# EasyEDA schematic SCH_solarWay_2025-11-07.json
TITLE: Sheet_1; REV: 1.0; Date: 2025-06-18; Sheet: 1/1; Drawn By: sahoneromassimo; Company: Your Company
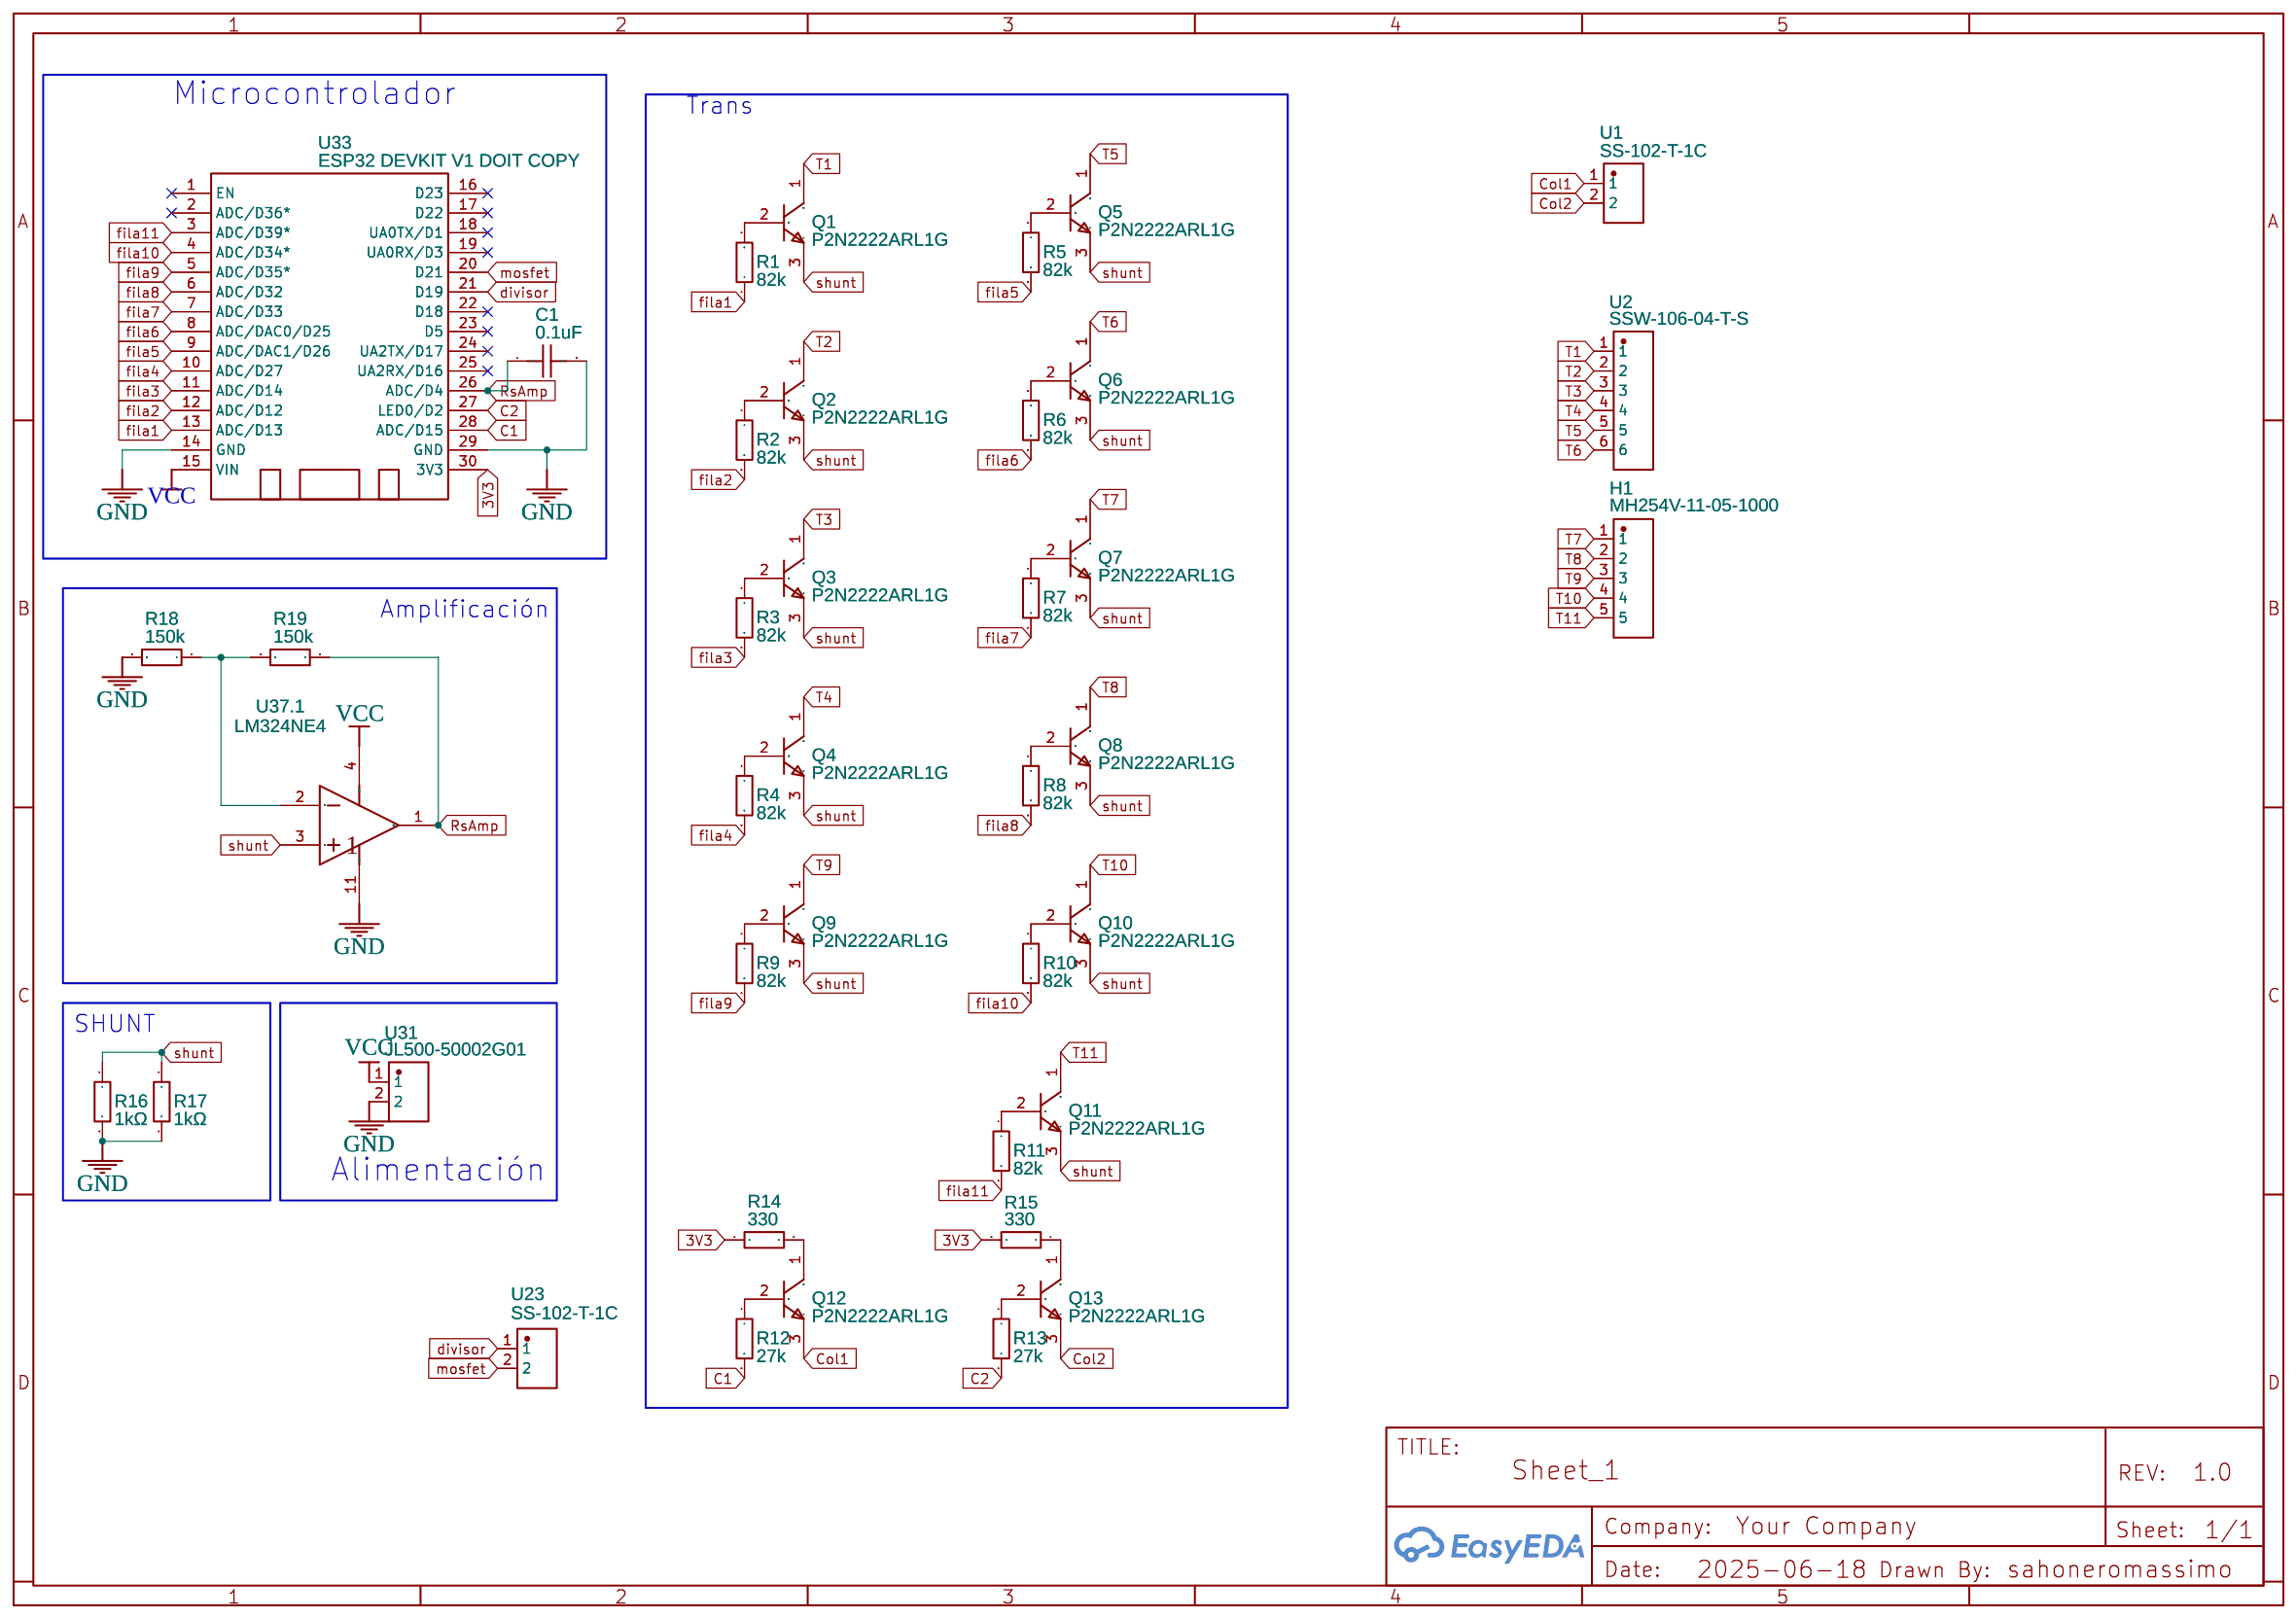
[diagram p0: schematic sheet]

## Parts
C1  0.1uF  [CAP-TH_L4.9-W3.7-P5.08-D0.5]
H1  MH254V-11-05-1000  [HDR-TH_5P-P2.54-V-M-1]
Q1  P2N2222ARL1G  [ONSC-TO-92-3-29-11_AM_BL]
Q2  P2N2222ARL1G  [ONSC-TO-92-3-29-11_AM_BL]
Q3  P2N2222ARL1G  [ONSC-TO-92-3-29-11_AM_BL]
Q4  P2N2222ARL1G  [ONSC-TO-92-3-29-11_AM_BL]
Q5  P2N2222ARL1G  [ONSC-TO-92-3-29-11_AM_BL]
Q6  P2N2222ARL1G  [ONSC-TO-92-3-29-11_AM_BL]
Q7  P2N2222ARL1G  [ONSC-TO-92-3-29-11_AM_BL]
Q8  P2N2222ARL1G  [ONSC-TO-92-3-29-11_AM_BL]
Q9  P2N2222ARL1G  [ONSC-TO-92-3-29-11_AM_BL]
Q10  P2N2222ARL1G  [ONSC-TO-92-3-29-11_AM_BL]
Q11  P2N2222ARL1G  [ONSC-TO-92-3-29-11_AM_BL]
Q12  P2N2222ARL1G  [ONSC-TO-92-3-29-11_AM_BL]
Q13  P2N2222ARL1G  [ONSC-TO-92-3-29-11_AM_BL]
R1  82k  [RES-TH_BD2.2-L6.5-P10.50-D0.6]
R2  82k  [RES-TH_BD2.2-L6.5-P10.50-D0.6]
R3  82k  [RES-TH_BD2.2-L6.5-P10.50-D0.6]
R4  82k  [RES-TH_BD2.2-L6.5-P10.50-D0.6]
R5  82k  [RES-TH_BD2.2-L6.5-P10.50-D0.6]
R6  82k  [RES-TH_BD2.2-L6.5-P10.50-D0.6]
R7  82k  [RES-TH_BD2.2-L6.5-P10.50-D0.6]
R8  82k  [RES-TH_BD2.2-L6.5-P10.50-D0.6]
R9  82k  [RES-TH_BD2.2-L6.5-P10.50-D0.6]
R10  82k  [RES-TH_BD2.2-L6.5-P10.50-D0.6]
R11  82k  [RES-TH_BD2.2-L6.5-P10.50-D0.6]
R12  27k  [RES-TH_BD2.2-L6.5-P10.50-D0.6]
R13  27k  [RES-TH_BD2.2-L6.5-P10.50-D0.6]
R14  330  [RES-TH_BD2.2-L6.5-P10.50-D0.6]
R15  330  [RES-TH_BD2.2-L6.5-P10.50-D0.6]
R16  1kΩ  [RES-TH_BD2.2-L6.5-P10.50-D0.6]
R17  1kΩ  [RES-TH_BD2.2-L6.5-P10.50-D0.6]
R18  150k  [RES-TH_BD2.2-L6.5-P10.50-D0.6]
R19  150k  [RES-TH_BD2.2-L6.5-P10.50-D0.6]
U1  SS-102-T-1C  [HDR-TH_2P-P2.54-V-M-1]
U2  SSW-106-04-T-S  [HDR-TH_6P-P2.54-V-M-1]
U23  SS-102-T-1C  [HDR-TH_2P-P2.54-V-M-1]
U31  JL500-50002G01  [CONN-TH_2P-P5.08_JL500-50002G01]
U33  ESP32 DEVKIT V1 DOIT COPY  [DOIT-ESP32-DEVKIT-V1]
U37  LM324NE4  [PDIP-14_L19.3-W6.4-P2.54-LS7.9-BL-1]  (section 1)

## Library data of the parts
C1 = CC4-0805-CG-100V-330PF-J: Contributor: LCSC; Supplier: LCSC; Supplier Part: C454432; Manufacturer: TORCH(火炬); Manufacturer Part: CC4-0805-CG-100V-330pF-J; JLCPCB Part Class: Extended Part
H1 = MH254V-11-05-1000: Contributor: LCSC; Supplier: LCSC; Supplier Part: C2889981; Manufacturer: XFCN(兴飞); JLCPCB Part Class: Extended Part
Q1-Q13 = P2N2222ARL1G: Amplifier Transistor, NPN Silicon, 3-Pin TO-92, Pb-Free, Tape and Reel
R1-R19 = CFR0W4J0242A50: Contributor: lcsc; Supplier: LCSC; Supplier Part: C2905203; Manufacturer: UNI-ROYAL(厚声); JLCPCB Part Class: Extended Part
U1 U23 = SS-102-T-1C: Supplier: LCSC; Supplier Part: C7369778; Manufacturer: SAMTEC; JLCPCB Part Class: Extended Part; Contributor: lcsc
U2 = SSW-106-04-T-S: Supplier: LCSC; Supplier Part: C7322394; Manufacturer: SAMTEC; JLCPCB Part Class: Extended Part; Contributor: lcsc
U31 = JL500-50002G01: Contributor: LCSC; Supplier: LCSC; Supplier Part: C394555; Manufacturer: JILN(锦凌); JLCPCB Part Class: Extended Part
U33 = ESP32 DEVKIT V1 DOIT COPY: Contributor: ConceitoTeam
U37 = LM324NE4: subpart_no: 1; Supplier: LCSC; Supplier Part: C1348021; Manufacturer: TI(德州仪器); JLCPCB Part Class: Extended Part

## Nets
3V3: R14.2 R15.2 U33.30(3V3)
GND: C1.2 R16.2 R17.2 R18.2 U31.2 U33.14(GND) U33.29(GND) U37.11(GND)
VCC: U31.1 U33.15(VIN) U37.4(VCC)
C1: R12.2 U33.28(ADC/D15)
C2: R13.2 U33.27(LED0/D2)
Col1: Q12.3(E) U1.1
Col2: Q13.3(E) U1.2
divisor: U23.1 U33.21(D19)
fila1: R1.1 U33.13(ADC/D13)
fila2: R2.2 U33.12(ADC/D12)
fila3: R3.2 U33.11(ADC/D14)
fila4: R4.2 U33.10(ADC/D27)
fila5: R5.2 U33.9(ADC/DAC1/D26)
fila6: R6.2 U33.8(ADC/DAC0/D25)
fila7: R7.2 U33.7(ADC/D33)
fila8: R8.2 U33.6(ADC/D32)
fila9: R9.2 U33.5(ADC/D35*)
fila10: R10.2 U33.4(ADC/D34*)
fila11: R11.2 U33.3(ADC/D39*)
mosfet: U23.2 U33.20(D21)
RsAmp: C1.1 R19.1 U33.26(ADC/D4) U37.1(OUT1)
shunt: Q1.3(E) Q2.3(E) Q3.3(E) Q4.3(E) Q5.3(E) Q6.3(E) Q7.3(E) Q8.3(E) Q9.3(E) Q10.3(E) Q11.3(E) R16.1 R17.1 U37.3(IN1+)
T1: Q1.1(C) U2.1
T2: Q2.1(C) U2.2
T3: Q3.1(C) U2.3
T4: Q4.1(C) U2.4
T5: Q5.1(C) U2.5
T6: Q6.1(C) U2.6
T7: H1.1 Q7.1(C)
T8: H1.2 Q8.1(C)
T9: H1.3 Q9.1(C)
T10: H1.4 Q10.1(C)
T11: H1.5 Q11.1(C)
Net-(Q1-2): Q1.2(B) R1.2
Net-(Q2-2): Q2.2(B) R2.1
Net-(Q3-2): Q3.2(B) R3.1
Net-(Q4-2): Q4.2(B) R4.1
Net-(Q5-2): Q5.2(B) R5.1
Net-(Q6-2): Q6.2(B) R6.1
Net-(Q7-2): Q7.2(B) R7.1
Net-(Q8-2): Q8.2(B) R8.1
Net-(Q9-2): Q9.2(B) R9.1
Net-(Q10-2): Q10.2(B) R10.1
Net-(Q11-2): Q11.2(B) R11.1
Net-(Q12-1): Q12.1(C) R14.1
Net-(Q12-2): Q12.2(B) R12.1
Net-(Q13-1): Q13.1(C) R15.1
Net-(Q13-2): Q13.2(B) R13.1
Net-(R18-1): R18.1 R19.2 U37.2(IN1-)

Not connected (* = marked no-connect by the designer): U33 1(EN)* 2(ADC/D36*)* 16(D23)* 17(D22)* 18(UA0TX/D1)* 19(UA0RX/D3)* 22(D18)* 23(D5)* 24(UA2TX/D17)* 25(UA2RX/D16)*

## Notes on the sheet
- Microcontrolador
- Trans
- Amplificación
- SHUNT
- Alimentación
